# Altium schematic sheet Bidirectional Voltage Translator.SchDoc: 3V3 - 1V8 Voltage Level Translator
size 292 x 193 mm; DocumentNumber: 11; SheetNumber: 9; SheetTotal: 44
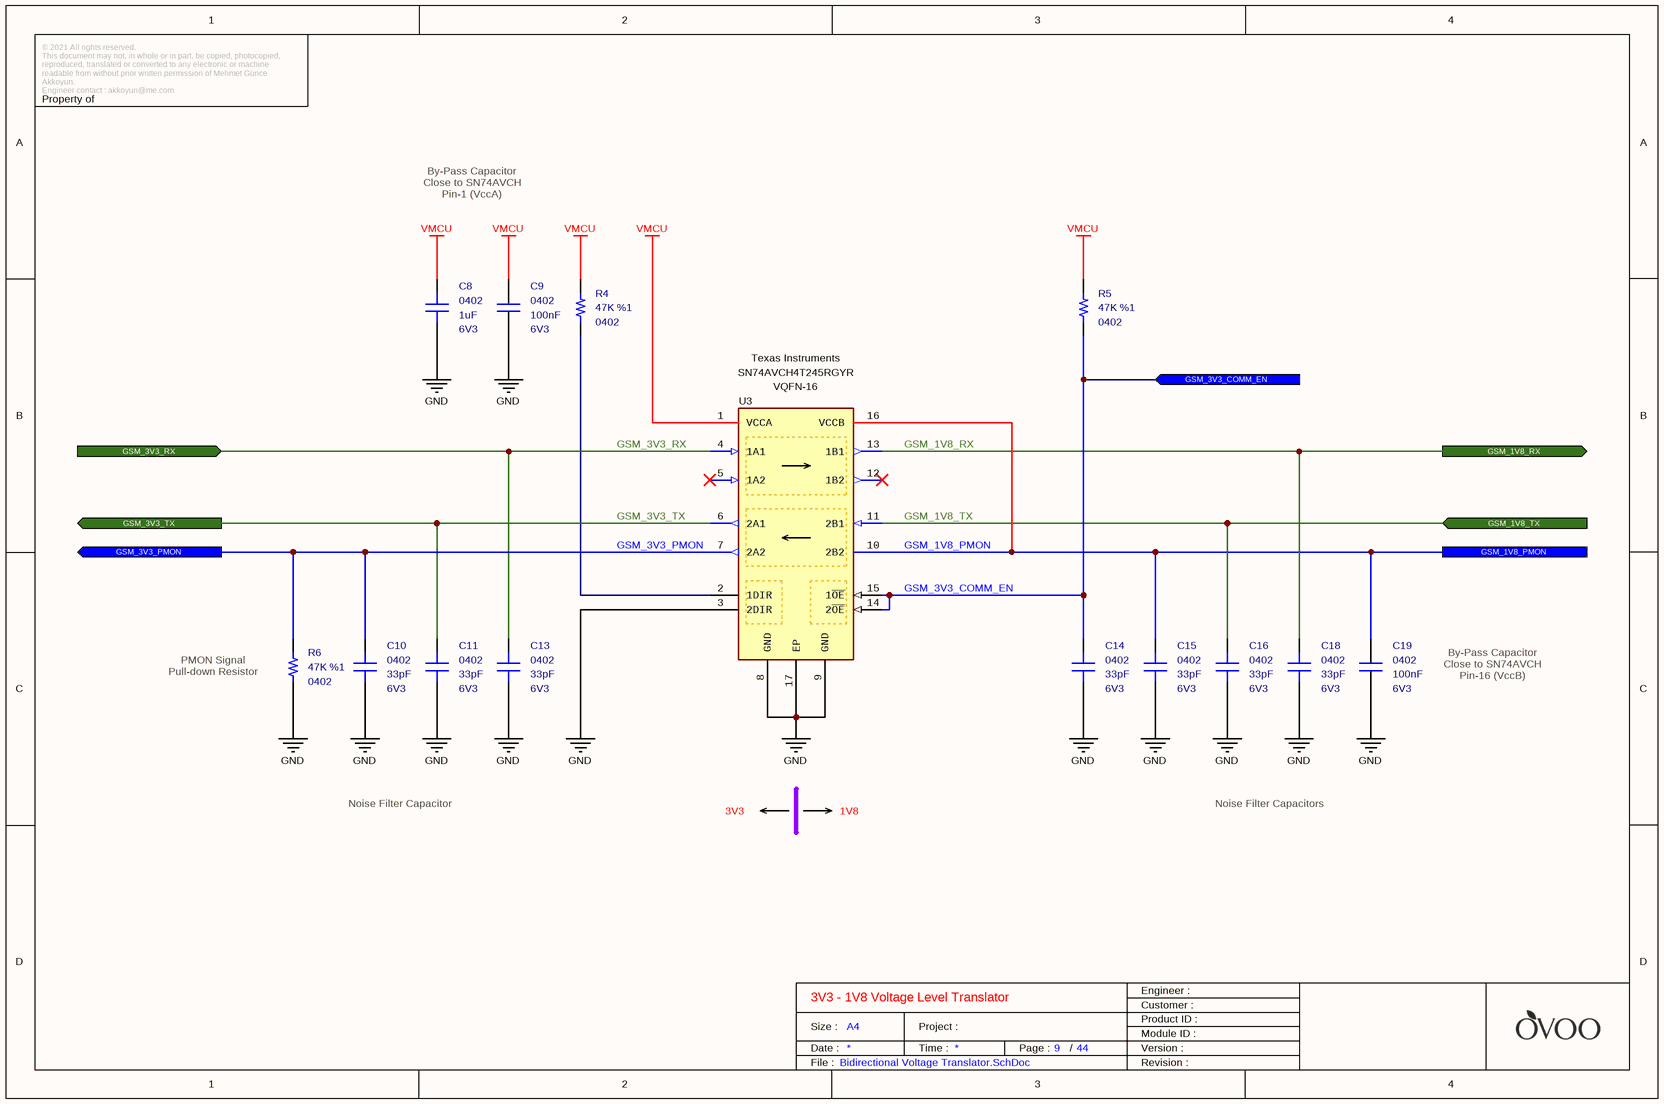
[diagram p0: Bidirectional Voltage Translator.SchDoc]

## Parts
C8  value 1uF  Case: 0402  Voltage: 6V3  [CAPACITOR_0402]  (hidden comment: Multilayer Ceramic Capacitor)
C9  value 100nF  Case: 0402  Voltage: 6V3  [CAPACITOR_0402]  (hidden comment: Multilayer Ceramic Capacitor)
C10  value 33pF  Case: 0402  Voltage: 6V3  [CAPACITOR_0402]  (hidden comment: Multilayer Ceramic Capacitor)
C11  value 33pF  Case: 0402  Voltage: 6V3  [CAPACITOR_0402]  (hidden comment: Multilayer Ceramic Capacitor)
C13  value 33pF  Case: 0402  Voltage: 6V3  [CAPACITOR_0402]  (hidden comment: Multilayer Ceramic Capacitor)
C14  value 33pF  Case: 0402  Voltage: 6V3  [CAPACITOR_0402]  (hidden comment: Multilayer Ceramic Capacitor)
C15  value 33pF  Case: 0402  Voltage: 6V3  [CAPACITOR_0402]  (hidden comment: Multilayer Ceramic Capacitor)
C16  value 33pF  Case: 0402  Voltage: 6V3  [CAPACITOR_0402]  (hidden comment: Multilayer Ceramic Capacitor)
C18  value 33pF  Case: 0402  Voltage: 6V3  [CAPACITOR_0402]  (hidden comment: Multilayer Ceramic Capacitor)
C19  value 100nF  Case: 0402  Voltage: 6V3  [CAPACITOR_0402]  (hidden comment: Multilayer Ceramic Capacitor)
R4  value 47K  Tolerance: %1  Case: 0402  [RESISTOR_0402]  (hidden comment: Thick Film Resistor)
R5  value 47K  Tolerance: %1  Case: 0402  [RESISTOR_0402]  (hidden comment: Thick Film Resistor)
R6  value 47K  Tolerance: %1  Case: 0402  [RESISTOR_0402]  (hidden comment: Thick Film Resistor)
U3  Manufacturer_Name: Texas Instruments  Manufacturer Part Number: SN74AVCH4T245RGYR  Case: VQFN-16  [VQFN16]  (hidden comment: Voltage Level Shifter)

## Ports
GSM_1V8_PMON, GSM_1V8_RX (out), GSM_1V8_TX (in), GSM_3V3_COMM_EN (in), GSM_3V3_PMON (out), GSM_3V3_RX (in), GSM_3V3_TX (out)

## Nets
GND: C8.1 C9.1 C10.1 C11.1 C13.1 C14.1 C15.1 C16.1 C18.1 C19.1 R6.1 U3.3(2DIR) U3.8(GND) U3.9(GND) U3.17(EP)
VMCU: C8.2 C9.2 R4.2 R5.2 U3.1(VCCA)
GSM_1V8_PMON: C15.2 C19.2 U3.10(2B2) U3.16(VCCB) ; port GSM_1V8_PMON
GSM_1V8_RX: C18.2 U3.13(1B1) ; port GSM_1V8_RX
GSM_1V8_TX: C16.2 U3.11(2B1) ; port GSM_1V8_TX
GSM_3V3_COMM_EN: C14.2 R5.1 U3.14(2~{OE}) U3.15(1~{OE}) ; port GSM_3V3_COMM_EN
GSM_3V3_PMON: C10.2 R6.2 U3.7(2A2) ; port GSM_3V3_PMON
GSM_3V3_RX: C13.2 U3.4(1A1) ; port GSM_3V3_RX
GSM_3V3_TX: C11.2 U3.6(2A1) ; port GSM_3V3_TX
NetR4_1: R4.1 U3.2(1DIR)

Not connected (* = marked no-connect by the designer): U3 5(1A2)* 12(1B2)*

## Notes on the sheet
- By-Pass Capacitor
  Close to SN74AVCH
  Pin-1 (VccA)
- (near R6) PMON Signal
  Pull-down Resistor
- By-Pass Capacitor
  Close to SN74AVCH
  Pin-16 (VccB)
- Noise Filter Capacitor
- 3V3
- 1V8
- Noise Filter Capacitors
- © 2021 All rights reserved.
  This document may not, in whole or in part, be copied, photocopied, reproduced, translated or converted to any electronic or machine readable from without prior written permission of Mehmet Günce Akkoyun.
  Engineer contact : akkoyun@me.com
- Property of
- Engineer :
- Date :
- Size :
- A4
- Time :
- Project :
- Page :
- /
- Customer :
- Product ID :
- Module ID :
- Version :
- File :
- Revision :

## Library data of the parts
C8 = Capacitor - 1uF [0402-6V3): Capacitor - 1uF [0402] (Ceramic); Manufacturer_Name: Murata Electronics; Manufacturer_Part_Number: GRM153R60J105ME95D; Dielectric: X5R; Tolerance: 20%; Height: 0.3mm; Mouser_Part_Number: 81-GRM153R60J105ME5D; Maximum Operating Temperature: +85; Minimum Operating Temperature: -55; RoHS: Yes; Weight: 6mg; ComponentLink1Description: DataSheet; ComponentLink1URL: https://psearch.en.murata.com/capacitor/product/GRM153R60J105ME95%23.html; ComponentLink2Description: Mouser; ComponentLink2URL: https://www.mouser.com/Search/Refine.aspx?Keyword=81-GRM153R60J105ME5D; Supplier 1: Future Electronics; Supplier 2: Future Electronics; Supplier 3: Mouser; Supplier 4: Arrow; Supplier 5: Digi-Key; Supplier Part Number 5: 490-14576-1-ND; Supplier Part Number 4: GRM153R60J105ME95D; Supplier Part Number 3: 81-GRM153R60J105ME5D; Supplier Part Number 2: GRM153R60J105ME95D-REEL; Supplier Part Number 1: GRM153R60J105ME95D-CUTT
C9 C19 = Capacitor - 100nF [0402-6V3]: Capacitor - 100nF [0402-6V3] (Ceramic); Manufacturer_Name: AVX; Manufacturer_Part_Number: 04026D104KAT4A; Dielectric: X5R; Tolerance: %10; Height: 0.25mm; Mouser_Part_Number: 581-04026D104KAT4A; ComponentLink1Description: Mouser; ComponentLink1URL: https://www.mouser.com.tr/ProductDetail/AVX/04026D104KAT4A?qs=sGAEpiMZZMs0AnBnWHyRQPg4iYkCw7IMED%2F4kpqgf7w%3D; ComponentLink2Description: DataSheet; ComponentLink2URL: https://www.mouser.com.tr/datasheet/2/40/cx5r-776519.pdf; ROHS: Yes; Maximum Operating Temperature: +85; Minimum Operating Temperature: -55; Supplier 1: Avnet; Supplier Part Number 1: 04026D104KAT4A
C10 C11 C13-C16 C18 = Capacitor - 33pF [0402-6V3]: Capacitor - 33pF [0402] (Ceramic); Manufacturer_Name: Kemet; Manufacturer_Part_Number: C0402C330J9RACAUTO; Dielectric: X7R; Tolerance: 10%; Height: 0.5mm; Mouser_Part_Number: 80-C0402C330J9RAUTO; Maximum Operating Temperature: +125; Minimum Operating Temperature: -55; ROHS: Yes; ComponentLink1Description: DataSheet; ComponentLink1URL: https://api.kemet.com/component-edge/download/datasheet/C0402C330J9RACAUTO.pdf; ComponentLink2Description: Mouser; ComponentLink2URL: https://www.mouser.com/Search/Refine.aspx?Keyword=80-C0402C330J9RAUTO; Supplier 1: Mouser; Supplier Part Number 1: 80-C0402C330J9RAUTO
R4-R6 = Resistor - 47K: Thick Film Resistors - SMD 1/16 W 47 Kohms 1%; Manufacturer_Name: Vishay; Manufacturer_Part_Number: CRCW040247K0FKED; Height: 0.4mm; Mouser_Part_Number: 71-CRCW0402-47K-E3; ComponentLink1Description: DataSheet; ComponentLink1URL: https://www.mouser.com.tr/datasheet/2/427/dcrcwe3-1762152.pdf; ComponentLink2Description: Mouser; ComponentLink2URL: https://www.mouser.com.tr/ProductDetail/Vishay-Dale/CRCW040247K0FKED?qs=sGAEpiMZZMu61qfTUdNhG2DpbjADlD3GL%252B3h1elTxqU%3D; Supplier 1: Mouser; Supplier 2: Digi-Key; Supplier Part Number 1: 71-CRCW040247K0FKEDH; Supplier Part Number 2: 541-47.0KYCT-ND
U3 = IC - SN74AVCH4T245: Translation - Voltage Levels Low Power Dual Channel; Supply Voltage - Max: 3.6V; Supply Voltage - Min: 1.2V; Height: 1mm; Mouser_Part_Number: 595-SN74AVCH4T245RGY; ComponentLink1Description: DataSheet; ComponentLink1URL: http://www.ti.com/general/docs/suppproductinfo.tsp?distId=26&gotoUrl=http%3A%2F%2Fwww.ti.com%2Flit%2Fgpn%2Fsn74avch4t245; Maximum Operating Temperature: +85; Minimum Operating Temperature: -40; ComponentLink2Description: Mouser; ComponentLink2URL: https://www.mouser.com.tr/ProductDetail/Texas-Instruments/SN74AVCH4T245RGYR?qs=PVVDbbWpW3IMTHF1QV2g%252BQ==; Supplier 1: Mouser; Supplier 2: Arrow; Supplier 3: Digi-Key; Supplier Part Number 1: 595-SN74AVCH4T245RGY; Supplier Part Number 2: SN74AVCH4T245RGYR; Supplier Part Number 3: 296-18262-1-ND